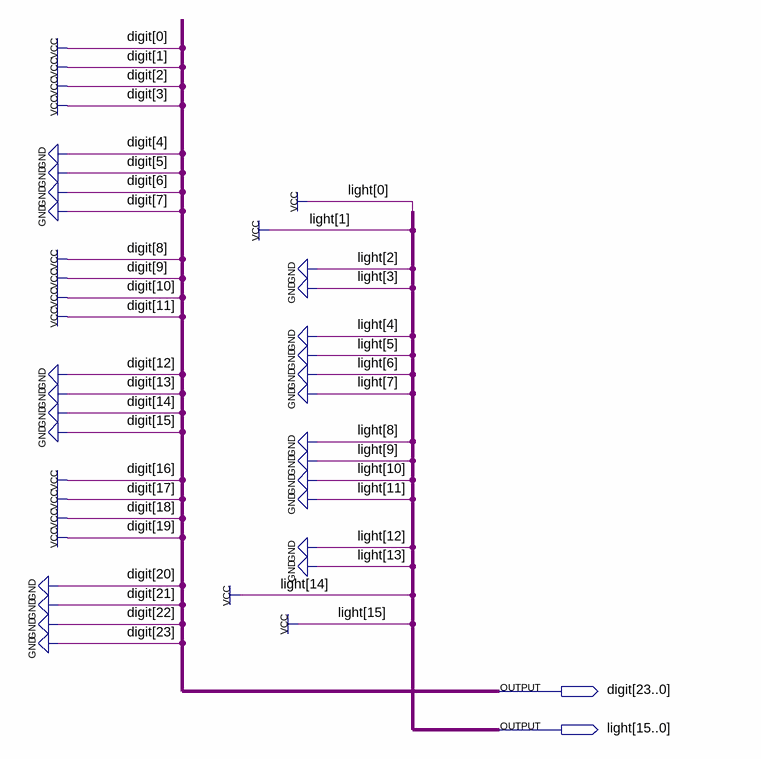
[diagram p0: schematic sheet]
// Quartus schematic Pattern_4_Frame_2.bdf as structural Verilog: 0 symbols, 2 pins
module Pattern_4_Frame_2 (
  output [23:0] digit,
  output [15:0] light
);


  assign digit = 24'b000011110000111100001111;
  assign light = 16'b1100000000000011;
endmodule
